# EAGLE design light-switch (EAGLE 9.6.2)
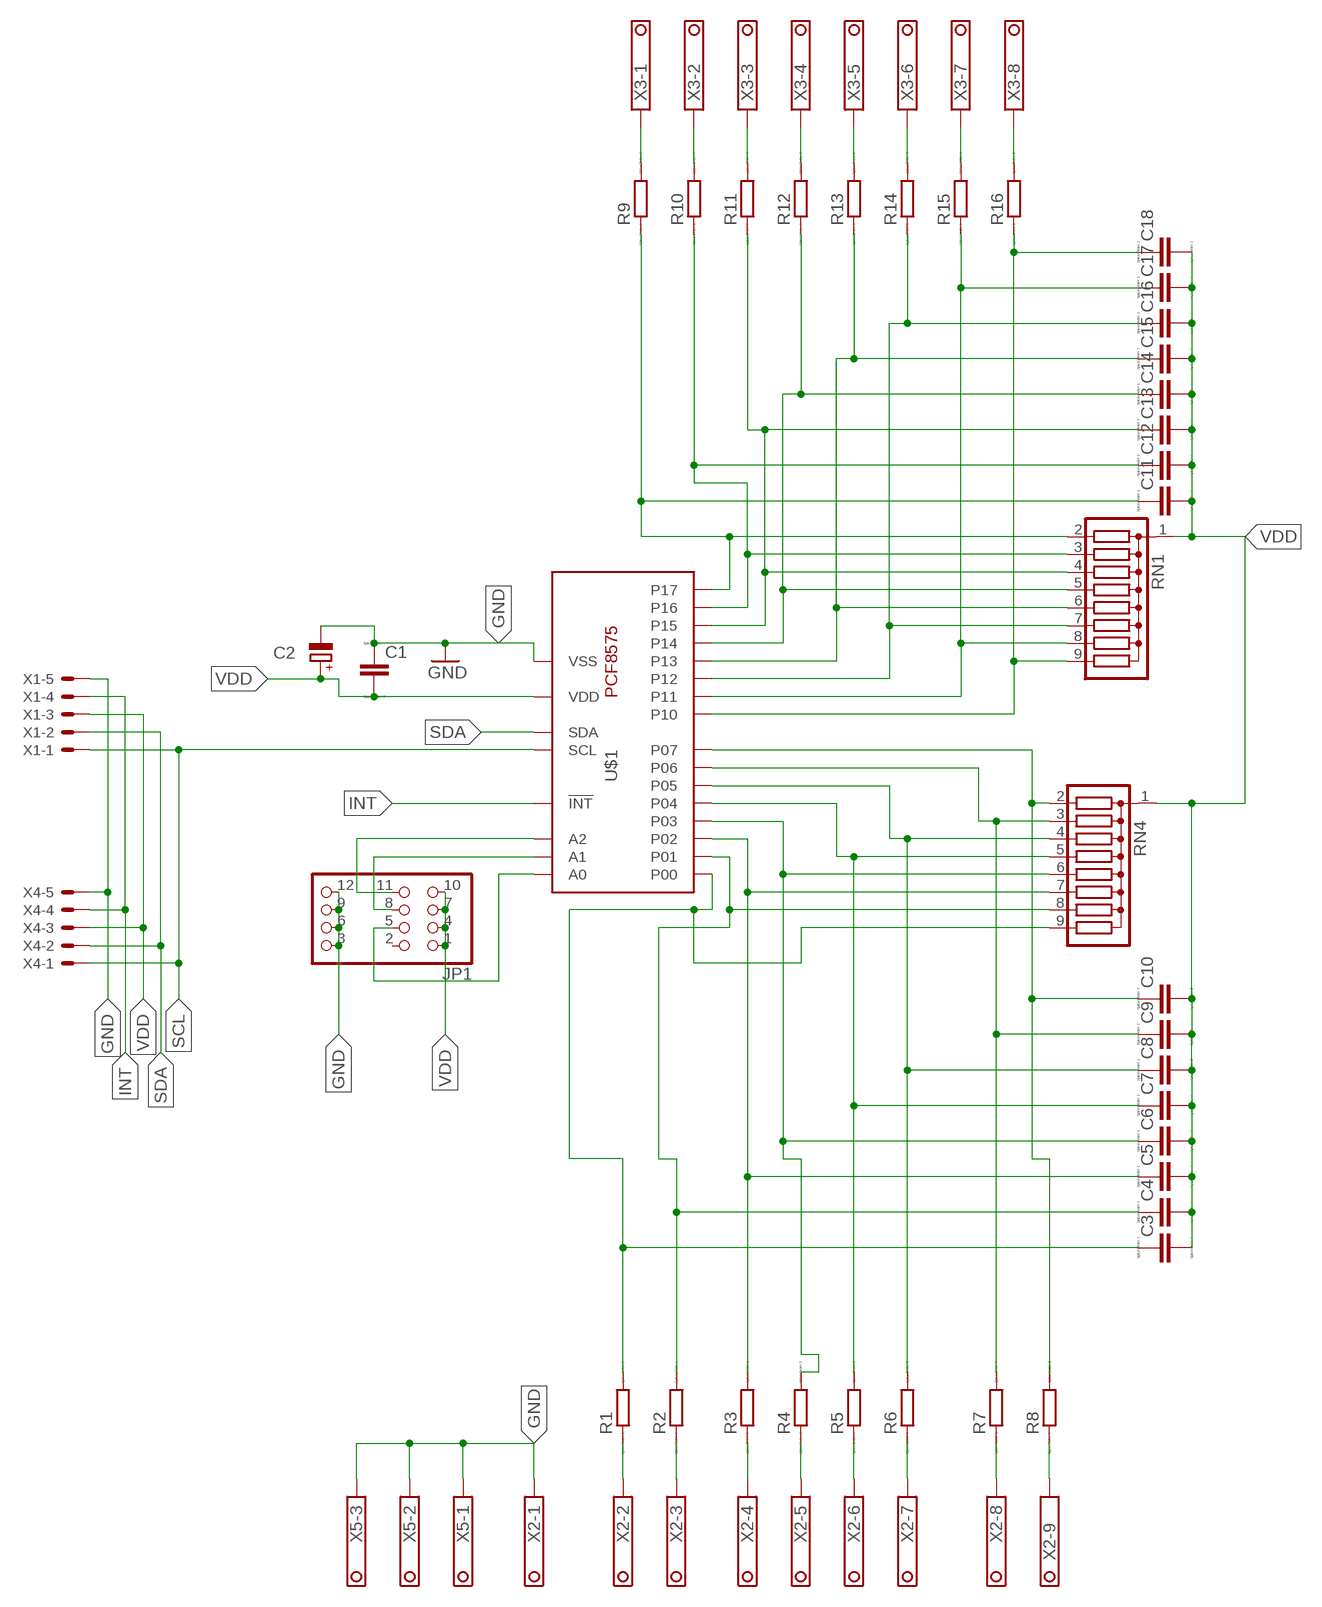
[diagram p0: schematic, sheet 1]

## Parts
C1  CC1206  [C1206]
C2  CPOL-EU150CLZ-0810  [150CLZ-0810]
C3  C  [C0805]
C4  C  [C0805]
C5  C  [C0805]
C6  C  [C0805]
C7  C  [C0805]
C8  C  [C0805]
C9  C  [C0805]
C10  C  [C0805]
C11  C  [C0805]
C12  C  [C0805]
C13  C  [C0805]
C14  C  [C0805]
C15  C  [C0805]
C16  C  [C0805]
C17  C  [C0805]
C18  C  [C0805]
JP1  PINHD-3X4  [3X04]
R1  RR1206  [R1206]
R2  RR1206  [R1206]
R3  RR1206  [R1206]
R4  RR1206  [R1206]
R5  RR1206  [R1206]
R6  RR1206  [R1206]
R7  RR1206  [R1206]
R8  RR1206  [R1206]
R9  RR1206  [R1206]
R10  RR1206  [R1206]
R11  RR1206  [R1206]
R12  RR1206  [R1206]
R13  RR1206  [R1206]
R14  RR1206  [R1206]
R15  RR1206  [R1206]
R16  RR1206  [R1206]
RN1  G08R  [SIL9]
RN4  G08R  [SIL9]
U$1  PCF8575CSSOP24  [SOP65P775X200-24N]
X1  JST-XH-05-PIN-LONG-PAD  [JST-XH-05-PACKAGE-LONG-PAD]
X2  TERMINAL-BLOCK-3.5MM-9-PIN-LONG-PAD  [TERMINAL-BLOCK-9-PIN-3.5MM-LONG-PAD]
X3  TERMINAL-BLOCK-3.5MM-8-PIN-LONG-PAD  [TERMINAL-BLOCK-8-PIN-3.5MM-LONG-PAD]
X4  JST-XH-05-PIN-LONG-PAD  [JST-XH-05-PACKAGE-LONG-PAD]
X5  TERMINAL-BLOCK-3.5MM-3-PIN-LONG-PAD  [TERMINAL-BLOCK-3-PIN-3.5MM-LONG-PAD]

## Nets
GND: C1.1 C2.- JP1.3 JP1.6 JP1.9 JP1.12 U$1.12(VSS) X1.5 X2.1 X4.5 X5.1 X5.2 X5.3
INT: U$1.1(!INT) X1.4 X4.4
N$1: C11.1 R9.1 RN1.2 U$1.20(P17)
N$2: R8.1 X2.9
N$3: C12.1 R10.1 RN1.3 U$1.19(P16)
N$4: C13.1 R11.1 RN1.4 U$1.18(P15)
N$5: C14.1 R12.1 RN1.5 U$1.17(P14)
N$6: C15.1 R13.1 RN1.6 U$1.16(P13)
N$7: C16.1 R14.1 RN1.7 U$1.15(P12)
N$8: C17.1 R15.1 RN1.8 U$1.14(P11)
N$9: C18.1 R16.1 RN1.9 U$1.13(P10)
N$10: C3.1 R1.2 RN4.9 U$1.4(P00)
N$11: C4.1 R2.2 RN4.8 U$1.5(P01)
N$12: C5.1 R3.2 RN4.7 U$1.6(P02)
N$13: C6.1 R4.2 RN4.6 U$1.7(P03)
N$14: C7.1 R5.2 RN4.5 U$1.8(P04)
N$15: C8.1 R6.2 RN4.4 U$1.9(P05)
N$16: C9.1 R7.2 RN4.3 U$1.10(P06)
N$17: C10.1 R8.2 RN4.2 U$1.11(P07)
N$18: R1.1 X2.2
N$19: JP1.11 U$1.3(A2)
N$20: JP1.8 U$1.2(A1)
N$21: JP1.5 U$1.21(A0)
N$22: R2.1 X2.3
N$23: R3.1 X2.4
N$24: R4.1 X2.5
N$25: R5.1 X2.6
N$26: R6.1 X2.7
N$27: R7.1 X2.8
N$28: R9.2 X3.1
N$29: R10.2 X3.2
N$30: R11.2 X3.3
N$31: R12.2 X3.4
N$32: R13.2 X3.5
N$33: R14.2 X3.6
N$34: R15.2 X3.7
N$35: R16.2 X3.8
SCL: U$1.22(SCL) X1.1 X4.1
SDA: U$1.23(SDA) X1.2 X4.2
VDD: C1.2 C2.+ C3.2 C4.2 C5.2 C6.2 C7.2 C8.2 C9.2 C10.2 C11.2 C12.2 C13.2 C14.2 C15.2 C16.2 C17.2 C18.2 JP1.1 JP1.4 JP1.7 JP1.10 RN1.1 RN4.1 U$1.24(VDD) X1.3 X4.3
Unconnected: JP1.2

## Library data of the parts
C1 C3-C18 = eagle-ltspice:C: CAPACITOR, European symbol; SPICEMODEL: NONE; SPICEPREFIX: C
C2 = rcl:CPOL-EU: POLARIZED CAPACITOR, European symbol; SPICEPREFIX: C
JP1 = pinhead-zmiany-JP:PINHD-3X4: PIN HEADER
R1-R16 = eagle-ltspice:R: RESISTOR, European symbol; SPICEMODEL: NONE; SPICEPREFIX: R
RN1 RN4 = resistor-sil:G08R: SIL RESISTOR; OC_FARNELL: unknown; OC_NEWARK: unknown
U$1 = pcf8575c:PCF8575C
X1 X4 = Rembrandt Electronics - JST XH Connectors v1-0:JST-XH-05-PIN: JST XH Connector 2 Pin Wire to board connector. Pitch: 2,54 mm, (0.100") Number of pins: 5 Created by Rembrandt Electronics www.rembrandtelectronics.com
X2 = Rembrandt Electronics - Terminal Block 3-5mm v1-0:TERMINAL-BLOCK-3.5MM-9-PIN: Terminal Block 3.5mm Pitch: 3,5 mm Number of pins: 9 Created by Rembrandt Electronics www.rembrandtelectronics.com
X3 = Rembrandt Electronics - Terminal Block 3-5mm v1-0:TERMINAL-BLOCK-3.5MM-8-PIN: Terminal Block 3.5mm Pitch: 3,5 mm Number of pins: 8 Created by Rembrandt Electronics www.rembrandtelectronics.com
X5 = Rembrandt Electronics - Terminal Block 3-5mm v1-0:TERMINAL-BLOCK-3.5MM-3-PIN: Terminal Block 3.5mm Pitch: 3,5 mm Number of pins: 3 Created by Rembrandt Electronics www.rembrandtelectronics.com

## Board
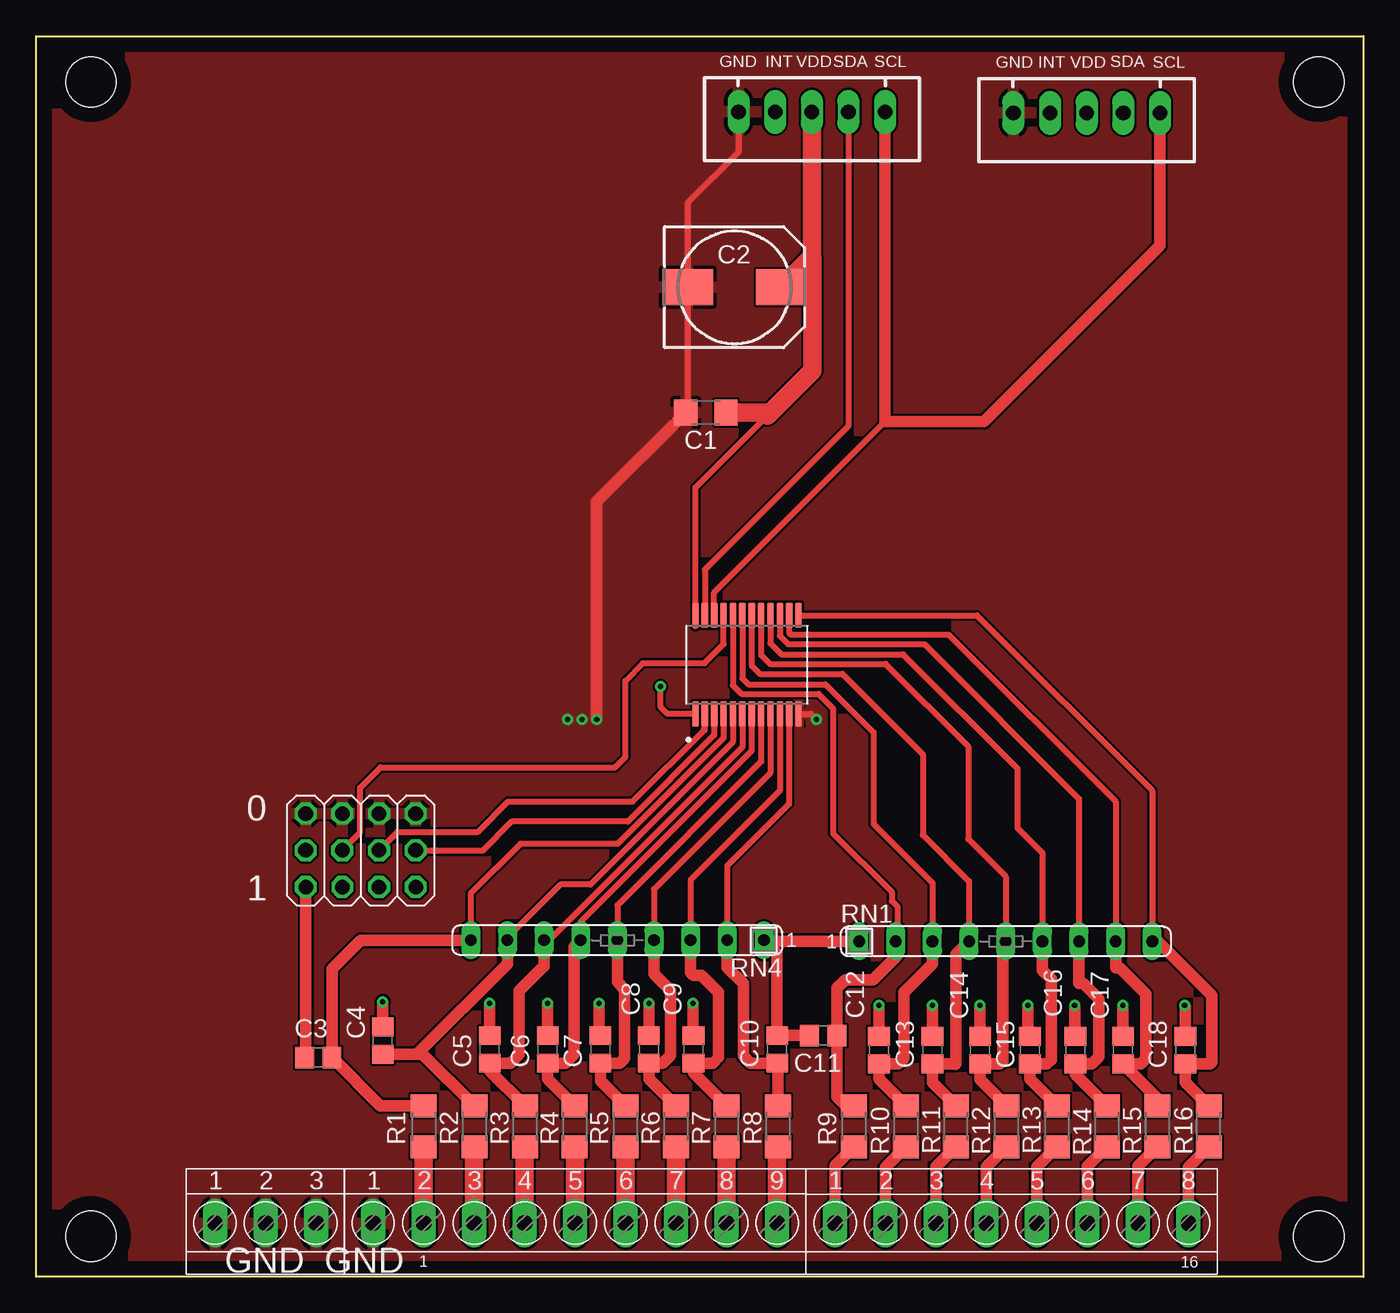
[diagram p1: board, top side]
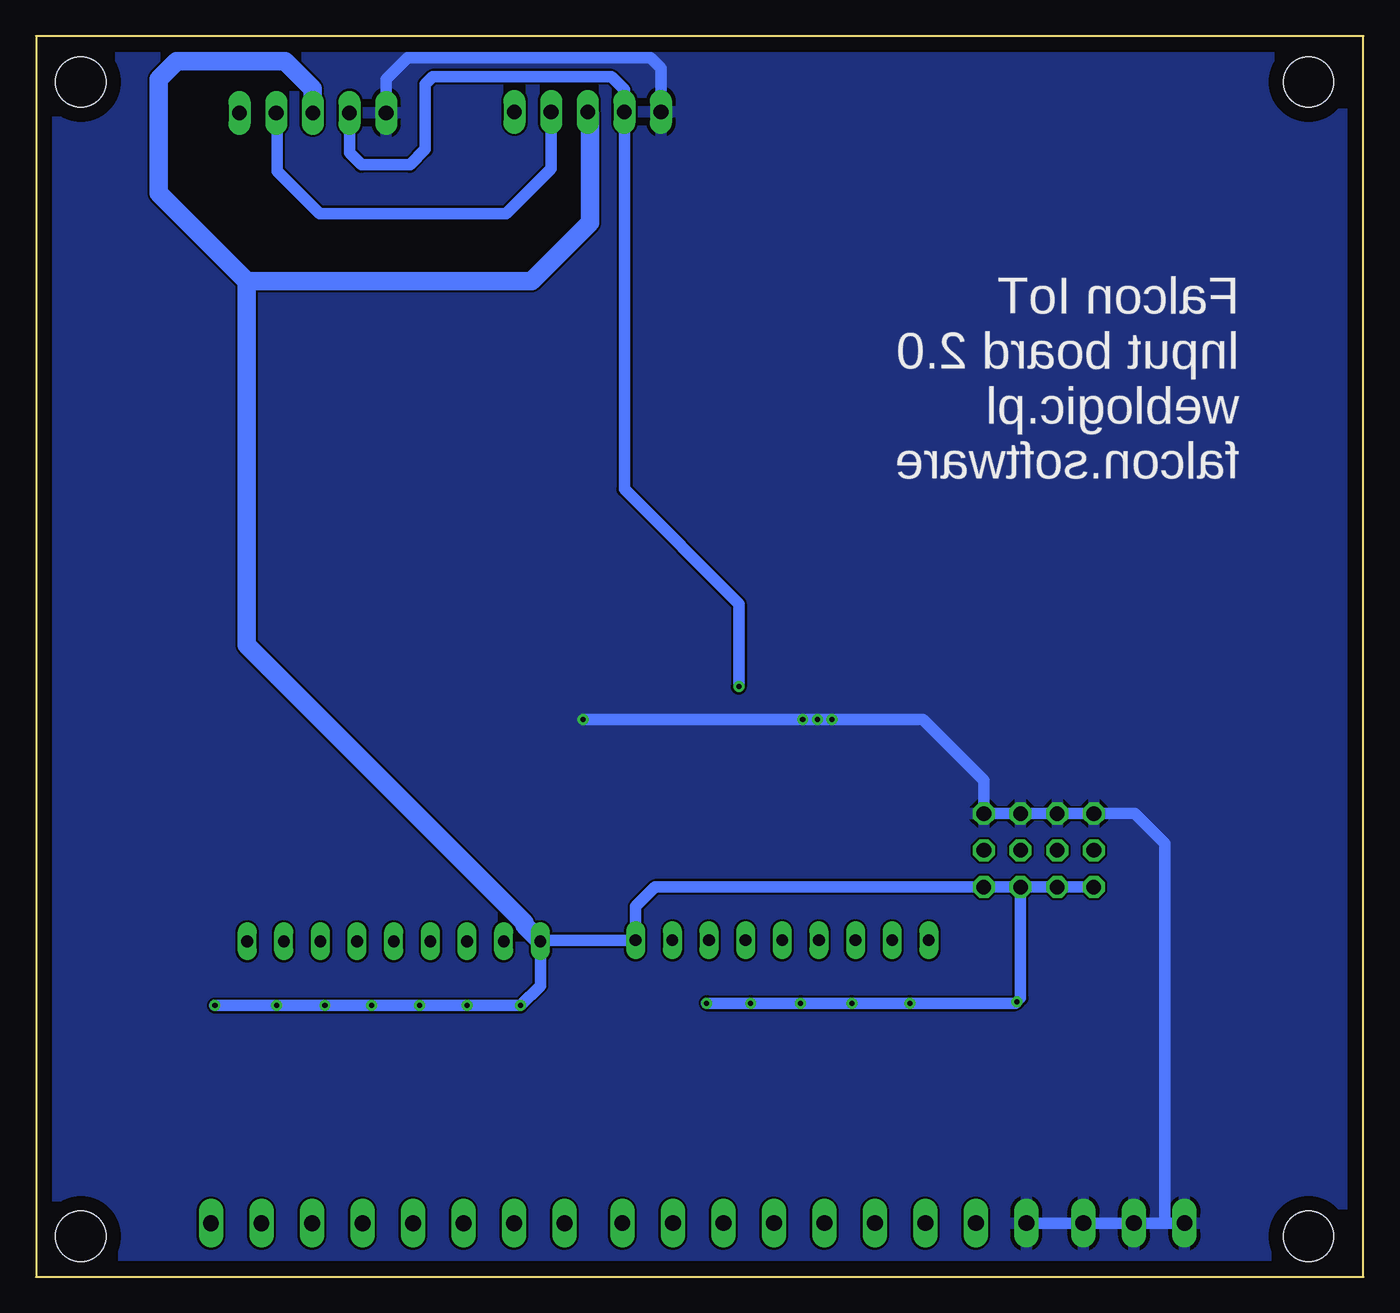
[diagram p2: board, bottom side, seen from below]

Size 92 x 86 mm. Coordinates in mm from the lower left corner, seen from the top.
Outline: 0,0 0,86 92,86 92,0 0,0
Copper layers (1*16): Top 0.035mm / dielectric 1.5mm / Bottom 0.035mm
Design rules "default": minimum track width 6mil, minimum drill 0.35mm, track to track 6mil, track to pad 6mil, pad to pad 6mil, via to via 6mil, smd to smd 6mil, copper to edge 40mil, drill to drill 6mil, minimum pad ring 10mil, minimum via ring 8mil, stop-mask expansion 4mil, vias tented up to drill 0mil, thermal gap 10mil
Holes 3.48 mm at 3.81,82.82 88.9,82.82 88.9,2.81 3.81,2.81

### Footprints (pad centres in the part's own frame; a part is rotated, then mirrored left to right if it is on the bottom)
C1206 = smd 1.6 x 1.8: 1 -1.4,0; 2 1.4,0
150CLZ-0810 = smd 3.5 x 2.5: + 3.25,0; - -3.25,0
C0805 = smd 1.3 x 1.5: 1 -0.95,0; 2 0.95,0
3X04 = drill 1 octagon: 1 -3.81,-3.81; 4 -1.27,-3.81; 7 1.27,-3.81; 10 3.81,-3.81 | drill 1.016 octagon: 2 -3.81,-1.27; 3 -3.81,1.27; 5 -1.27,-1.27; 6 -1.27,1.27; 8 1.27,-1.27; 9 1.27,1.27; 11 3.81,-1.27; 12 3.81,1.27
R1206 = smd 1.6 x 1.803: 1 -1.422,0; 2 1.422,0
SIL9 = drill 0.813 long: 1 -10.16,0; 2 -7.62,0; 3 -5.08,0; 4 -2.54,0; 5 0,0; 6 2.54,0; 7 5.08,0; 8 7.62,0; 9 10.16,0
SOP65P775X200-24N = smd 1.78 x 0.48: 1 -3.42,3.575; 2 -3.42,2.925; 3 -3.42,2.275; 4 -3.42,1.625; 5 -3.42,0.975; 6 -3.42,0.325; 7 -3.42,-0.325; 8 -3.42,-0.975; 9 -3.42,-1.625; 10 -3.42,-2.275; 11 -3.42,-2.925; 12 -3.42,-3.575; 13 3.42,-3.575; 14 3.42,-2.925; 15 3.42,-2.275; 16 3.42,-1.625; 17 3.42,-0.975; 18 3.42,-0.325; 19 3.42,0.325; 20 3.42,0.975; 21 3.42,1.625; 22 3.42,2.275; 23 3.42,2.925; 24 3.42,3.575
JST-XH-05-PACKAGE-LONG-PAD = drill 1.016 long: 1 -5.08,0; 2 -2.54,0; 3 0,0; 4 2.54,0; 5 5.08,0
TERMINAL-BLOCK-9-PIN-3.5MM-LONG-PAD = drill 1.1 pad 1.7 long: 1 -13.973,-0.1; 2 -10.473,-0.1; 3 -6.973,-0.1; 4 -3.473,-0.1; 5 0.028,-0.1; 6 3.527,-0.1; 7 7.027,-0.1; 8 10.527,-0.1; 9 14.027,-0.1
TERMINAL-BLOCK-8-PIN-3.5MM-LONG-PAD = drill 1.1 pad 1.7 long: 1 -12.25,-0.1; 2 -8.75,-0.1; 3 -5.25,-0.1; 4 -1.75,-0.1; 5 1.75,-0.1; 6 5.25,-0.1; 7 8.75,-0.1; 8 12.25,-0.1
TERMINAL-BLOCK-3-PIN-3.5MM-LONG-PAD = drill 1.1 pad 1.7 long: 1 -3.5,-0.1; 2 0,-0.1; 3 3.5,-0.1

### Placement (x,y rotation side)
C1  46.43,59.91 0 top
C2  48.41,68.6 0 top
C3  19.56,15.21 180 top
C4  24.03,16.37 90 top
C5  31.45,15.76 90 top
C6  35.46,15.76 90 top
C7  39.12,15.76 90 top
C8  42.47,15.76 90 top
C9  45.57,15.76 90 top
C10  51.36,15.76 90 top
C11  54.56,16.73 180 top
C12  58.42,15.71 90 top
C13  62.13,15.71 90 top
C14  65.43,15.71 90 top
C15  68.88,15.71 90 top
C16  72.03,15.71 90 top
C17  75.34,15.71 90 top
C18  79.65,15.71 90 top
JP1  22.5,30.83 0 top
R1  26.87,10.43 90 top
R2  30.38,10.43 90 top
R3  33.88,10.43 90 top
R4  37.34,10.43 90 top
R5  40.84,10.43 90 top
R6  44.35,10.43 90 top
R7  47.85,10.43 90 top
R8  51.41,10.43 90 top
R9  56.69,10.43 270 top
R10  60.3,10.43 270 top
R11  63.75,10.43 270 top
R12  67.26,10.43 270 top
R13  70.76,10.43 270 top
R14  74.22,10.43 270 top
R15  77.72,10.43 270 top
R16  81.28,10.43 270 top
RN1  67.21,23.26 0 top
RN4  40.28,23.33 180 top
U$1  49.28,42.43 90 top
X1  53.77,80.75 180 top
X2  37.34,3.83 0 top
X3  67.63,3.82 0 top
X4  72.82,80.67 180 top
X5  15.9,3.83 0 top

### Tracks (layer width: path | path; a pad name or v marks a point on that pad's centre or on a via)
GND  (via drill 0.35)
  Top 0.406: 44.53,59.41 C1.1 45.16,60.04 C2.- 45.16,74.44 48.69,77.96 X1.5 | U$1.12 53.71,39.01 v54.1,38.62
  Top 0.813: C1.1 38.86,53.74 v38.86,38.62
  Bottom 0.813: v54.1,38.62 v38.86,38.62 v37.85,38.62 v36.83,38.62 30.53,38.62 26.31,34.4 JP1.12 JP1.9 JP1.6 JP1.3 15.83,32.1 13.77,30.04 13.77,3.97 14.01,3.73 | X1.5 48.69,83.76 49.43,84.5 66.24,84.5 67.73,83 X4.5 | X2.1 19.56,3.73 X5.2 14.01,3.73 | X5.1 14.01,3.73
  pour Bottom: 0,86.02 91.74,86.02 92,85.77 92,0.12 0.46,0.12 0,-0.34 0,85.87 -0.15,86.02
  pour Top: 0.15,85.87 91.74,85.87 92.05,86.17 92.05,-0.09 92.3,-0.34 0.15,-0.34 0.15,85.61 0.41,85.61
INT  (via drill 0.35)
  Top 0.406: U$1.1 43.76,39.01 43.28,39.49 v43.28,40.91
  Bottom 0.813: X4.4 70.28,77.91 69.44,77.08 66.09,77.08 65.02,78.15 65.02,82.67 64.52,83.18 52.12,83.18 51.23,82.28 X1.4 51.23,54.59 43.28,46.65 v43.28,40.91
N$1
  Top 0.406: U$1.20 48.3,41 48.9,40.4 54.23,40.4 55.24,39.39 55.24,30.75 59.31,26.69 59.31,26.05 59.69,25.67 59.69,23.36 RN1.2
  Top 0.813: R9.1 56.13,11.85 55.51,12.48 C11.1 55.51,20.02 56.08,20.59 58.01,20.59 59.69,22.27 59.69,23.36
N$2
  Top 1.27: X2.9 51.37,8.96 R8.1
N$3
  Top 0.406: U$1.19 48.95,41.48 49.38,41.06 54.71,41.06 58.04,37.73 58.04,31.38 62.13,27.3 RN1.3
  Top 0.813: R10.1 58.42,13.73 C12.1 59.76,14.76 60.15,15.15 60.15,19.73 62.13,21.71 RN1.3
N$4
  Top 0.406: U$1.18 49.6,42.36 50.16,41.8 55.88,41.8 61.47,36.21 61.47,30.62 64.67,27.42 RN1.4
  Top 0.813: R11.1 62.13,13.48 C13.1 63.74,14.76 | 63.74,14.76 63.75,14.75 63.73,14.72 | 63.74,14.76 63.75,14.78 63.75,22.34 RN1.4
N$5
  Top 0.406: 50.27,45.87 U$1.17 50.25,43.09 50.85,42.48 58.88,42.48 64.62,36.74 64.62,30.34 67.21,27.75 RN1.5
  Top 0.813: R12.1 65.43,13.68 C14.1 66.82,14.76 67,14.95 67,23.05 RN1.5
N$6
  Top 0.406: U$1.16 50.9,43.91 51.66,43.15 60.1,43.15 68.02,35.22 68.02,31.11 69.75,29.38 RN1.6
  Top 0.813: R13.1 68.89,13.73 C15.1 70.07,14.76 70.36,15.05 70.36,20.64 69.75,21.25 RN1.6
N$7
  Top 0.406: U$1.15 51.55,44.43 52.12,43.86 61.57,43.86 72.29,33.14 RN1.7
  Top 0.813: R14.1 72.03,14.04 C16.1 73.17,14.76 73.66,15.26 73.66,19.27 72.59,20.34 72.29,20.34 RN1.7
N$8
  Top 0.406: U$1.14 52.2,44.64 52.32,44.52 63.25,44.52 74.83,32.93 RN1.8
  Top 0.813: R15.1 77.72,12.38 C17.1 76.57,14.76 76.91,15.1 76.91,19.62 75.13,21.4 74.83,21.4 RN1.8
N$9
  Top 0.406: U$1.13 65.21,45.85 77.37,33.7 RN1.9
  Top 0.813: R16.1 79.65,13.48 C18.1 81.4,14.76 81.48,14.85 81.48,19.52 77.75,23.26 RN1.9
N$10
  Top 0.406: U$1.4 47.65,37.35 40.31,30.01 33.58,30.01 30.12,26.56 RN4.9
  Top 0.813: R1.2 23.86,11.85 C3.1 20.51,21.34 22.5,23.33 RN4.9
N$11
  Top 0.406: U$1.5 48.3,37.06 38.43,27.19 36.35,27.19 32.66,23.51 RN4.8
  Top 0.813: R2.2 26.81,15.42 C4.1 24.04,15.41 26.36,15.41 32.66,21.71 RN4.8
N$12
  Top 0.406: U$1.6 48.95,36.72 35.56,23.33 RN4.7
  Top 0.813: R3.2 31.45,14.29 C5.1 32.88,14.81 33.48,15.41 33.48,19.83 35.1,21.45 35.15,21.45 35.2,21.5 RN4.7
N$13
  Top 0.406: U$1.7 49.6,36.46 37.74,24.6 RN4.6
  Top 0.813: R4.2 35.46,13.73 C6.1 36.69,14.81 37.29,15.41 37.29,22.88 RN4.6
N$14
  Top 0.406: U$1.8 50.25,35.71 40.28,25.75 RN4.5
  Top 0.813: R5.2 39.12,13.58 C7.1 40.45,14.81 40.79,15.15 40.79,19.93 40.28,20.44 RN4.5
N$15
  Top 0.406: U$1.9 50.9,34.94 42.82,26.86 RN4.4
  Top 0.813: R6.2 42.47,13.73 C8.1 43.42,14.81 43.43,14.8 43.98,15.35 43.98,19.84 42.82,21 RN4.4
N$16
  Top 0.406: U$1.10 51.55,33.71 45.36,27.52 RN4.3
  Top 0.813: R7.2 45.57,14.14 C9.1 46.9,14.81 47.3,15.2 47.3,19.73 46.13,20.89 45.57,20.89 45.36,21.1 RN4.3
N$17
  Top 0.406: U$1.11 52.2,32.76 47.9,28.46 RN4.2
  Top 0.813: R8.2 51.41,14.76 C10.1 49.52,14.81 49.02,15.31 49.02,20.34 47.9,21.45 RN4.2
N$18
  Top 1.27: X2.2 R1.1
N$19
  Top 0.406: U$1.3 47,37.55 41.02,31.56 32.97,31.56 30.94,29.53 26.34,29.53 JP1.11
N$20
  Top 0.406: JP1.8 25.06,30.85 30.63,30.85 32.72,32.93 41.35,32.93 46.29,37.87 | 46.33,37.87 46.29,37.87 | 46.29,37.87 46.29,38 46.35,38.06 U$1.2
N$21
  Top 0.406: JP1.5 22.45,30.79 22.45,33.9 23.88,35.32 40.13,35.32 40.84,36.03 40.84,41.32 42.06,42.54 46.33,42.54 47.65,43.86 U$1.21
N$22
  Top 1.27: X2.3 30.37,8.99 R2.1
N$23
  Top 1.27: X2.4 33.87,8.99 R3.1
N$24
  Top 1.27: X2.5 37.37,8.98 R4.1
N$25
  Top 1.27: X2.6 40.87,8.99 R5.1
N$26
  Top 1.27: X2.7 44.37,8.99 R6.1
N$27
  Top 1.27: X2.8 47.87,9 R7.1
N$28
  Top 0.813: R9.2 55.38,7.69 X3.1
N$29
  Top 0.813: X3.2 58.88,7.59 R10.2
N$30
  Top 0.813: X3.3 62.38,7.63 R11.2
N$31
  Top 0.813: X3.4 65.88,7.63 R12.2
N$32
  Top 0.813: X3.5 69.38,7.62 R13.2
N$33
  Top 0.813: R14.2 72.88,7.67 X3.6
N$34
  Top 0.813: R15.2 76.38,7.66 X3.7
N$35
  Top 0.813: X3.8 79.88,7.61 R16.2
SCL
  Top 0.406: U$1.22 47,47.42 58.84,59.27
  Top 0.813: X1.1 58.84,59.27 65.7,59.27 77.89,71.46 X4.1
SDA
  Top 0.406: X1.2 56.3,58.96 46.35,49.01 U$1.23
  Bottom 0.813: X1.2 56.3,76.81 59.44,73.68 72.34,73.68 75.29,76.62 75.29,80.6 X4.2
VDD  (via drill 0.35)
  Top 0.406: 45.7,45.09 45.72,45.11 45.72,46.4 45.7,46.38 U$1.24 45.7,54.71 50.7,59.71 50.9,59.91 | 50.9,59.91 53.8,62.8 53.8,68.39 | 53.8,68.39 53.8,70.63 53.8,80.72 X1.3 | C2.+ 53.59,68.6 53.8,68.39 | C1.2 50.9,59.91
  Top 0.813: RN1.1 50.52,23.26 | 50.52,23.26 RN4.1 | JP1.1 18.69,15.29 C3.2 | C6.2 v35.46,18.96 | C5.2 v31.45,18.96 | C4.2 v24.03,19.07 | C7.2 39.01,16.82 v39.01,18.96 | C8.2 v42.47,18.96 | C9.2 45.52,16.77 v45.52,18.96 | 50.52,23.26 51.36,22.42 C10.2 51.37,16.73 C11.2 | C12.2 v58.42,18.81 | C13.2 v62.13,18.81 | C14.2 v65.43,18.81 | C15.2 68.73,16.82 v68.73,18.81 | C16.2 71.98,16.71 v71.98,18.81 | C17.2 v75.34,18.81 | C18.2 79.65,18.76 v79.6,18.81
  Top 1.27: X1.3 53.77,70.7 C2.+ | 53.8,70.63 53.8,62.8 50.7,59.71 50.49,59.91 C1.2
  Bottom 0.813: JP1.1 JP1.4 JP1.7 | JP1.7 JP1.10 49.09,27.02 50.44,25.67 RN4.1 56.97,23.33 RN1.1 57.05,20.18 v58.42,18.81 v62.13,18.81 v65.43,18.81 v68.73,18.81 v71.98,18.81 v75.34,18.81 v79.6,18.81 | v45.52,18.96 v42.47,18.96 v39.01,18.96 v35.46,18.96 v31.45,18.96 24.13,18.96 v24.03,19.07 23.77,19.33 JP1.7
  Bottom 1.27: X4.3 72.81,82.36 74.73,84.27 82.27,84.27 83.52,83.02 83.52,75.1 77.42,69 | X1.3 53.59,80.58 53.59,73.07 57.66,69 77.42,69 | RN1.1 58.14,24.35 58.14,24.52 77.42,43.8 77.42,69

### Text on the board
tNames: GND | INT | VDD | SDA | SCL | GND | INT | VDD | SDA | SCL | 0 | 1 | 1 | 16 | GND | GND
bNames: Falcon IoT / lnput board 2.0 / weblogic.pl / falcon.software